# Altium project Thunderscope_Rev4.1.PrjPCB (part 1 of 2)
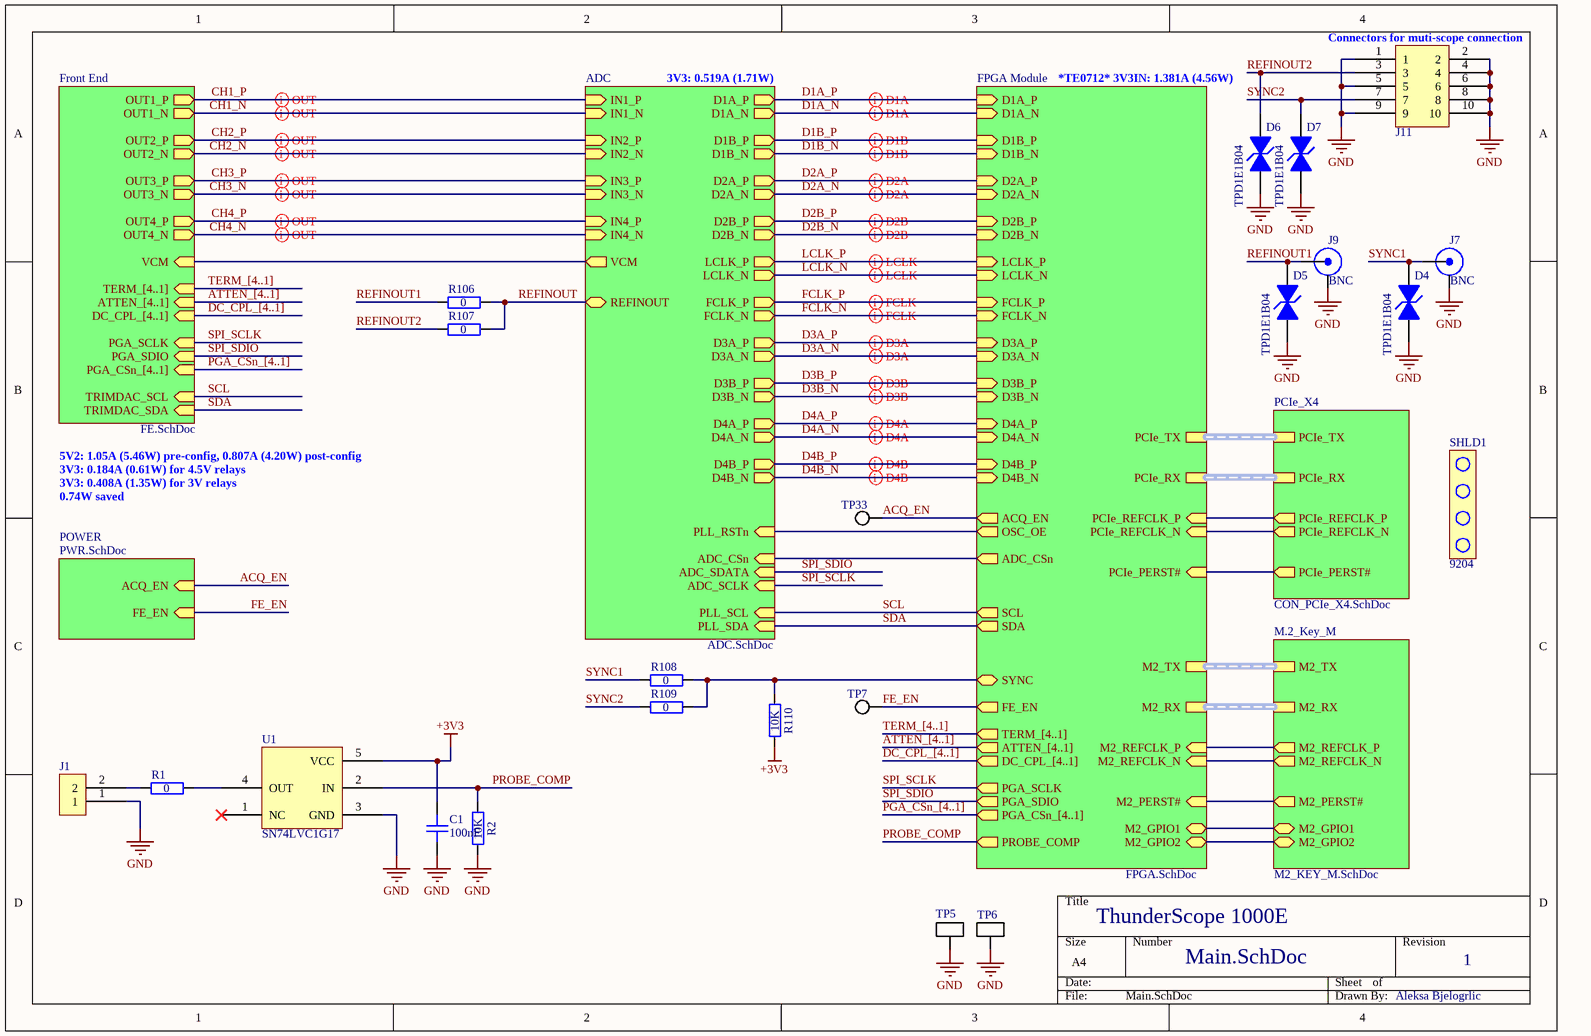
[diagram p0: Main.SchDoc]
Template Notes: - Nominal values used, dimensions in mm  - The mounting holes and keep-out areas around them are only required when the I/O bracket is mounted on the card directly  - Component height rule and clearance rule derived from PCI_Express_CEM_r2.0.pdf, Page 84.  - Stackup is not specified in PCI_Express_CEM_r2.0.pdf, nor implemented in this template.; Template Revision Date: Oct 29, 2010; Template Source Document: Outline:PCI_Express_CEM_r2.0.pdf  Pinout:PCI_Express_CEM_r2.0.pdf; Template Source Organization: PCI-SIG; Template Source Revision Date: R2.0, April 11, 2007; Template Source URL: http://www.pcisig.com; Title: ThunderScope 1000E
8 sheets, 654 parts. Net scope: hierarchical (ports join the sheet entries above them; power ports are global).
Board file: Thunderscope_Rev4.1.PCBDOC
Sheets:
  Main.SchDoc
    Front End = FE.SchDoc
      CH1 = FE_Channel.SchDoc
      CH2 = FE_Channel.SchDoc
      CH3 = FE_Channel.SchDoc
      CH4 = FE_Channel.SchDoc
    ADC = ADC.SchDoc
      PLL = PLL.SchDoc
    FPGA Module = FPGA.SchDoc
    M.2_Key_M = M2_KEY_M.SchDoc
    POWER = PWR.SchDoc

## Sheet Main.SchDoc: ThunderScope 1000E
size A4; DrawnBy: Aleksa Bjelogrlic; Revision: 1

### Parts
C1  100nF  [GEN_C_0402]
D4  TPD1E1B04  [TI_X1SON_DPY0002A]
D5  TPD1E1B04  [TI_X1SON_DPY0002A]
D6  TPD1E1B04  [TI_X1SON_DPY0002A]
D7  TPD1E1B04  [TI_X1SON_DPY0002A]
J1  TSW-101-08-F-D-RA  [GEN_2.54mm_1x2_Pin_TH_RA]  (value not drawn)
J7  BNC  [MOL_0731000105]
J9  BNC  [MOL_0731000105]
J11  1.27mm 6 Pin TH  [GEN_1.27mm_2x5_Pin_TH_RA]  (value not drawn)
R1  0  [GEN_R_0402]
R2  10K  [GEN_R_0402]
R106  0  [GEN_R_0402]
R107  0  [GEN_R_0402]
R108  0  [GEN_R_0402]
R109  0  [GEN_R_0402]
R110  10K  [GEN_R_0402]
SHLD1  9204  (mechanical)
TP5  5019  [KEY_5019]  (value not drawn)
TP6  5019  [KEY_5019]  (value not drawn)
TP7  PCB  [GEN_TP_PCB]  (value not drawn)  (no BOM)
TP33  PCB  [GEN_TP_PCB]  (value not drawn)  (no BOM)
U1  SN74LVC1G17  [GEN_SC-70-5]

### Sub-sheets
ADC = ADC.SchDoc: IN4_N (in), IN4_P (in), IN3_N (in), IN3_P (in), IN2_N (in), IN2_P (in), VCM (out), IN1_N (in), IN1_P (in), ADC_CSn (in), ADC_SDATA (in), ADC_SCLK (in), D1A_N (out), D1A_P (out), D1B_P (out), D1B_N (out), D2A_P (out), D2A_N (out), D2B_N (out), D2B_P (out), LCLK_P (out), LCLK_N (out), FCLK_N (out), FCLK_P (out), D3A_P (out), D3A_N (out), D3B_P (out), D3B_N (out), D4A_P (out), D4A_N (out), D4B_P (out), D4B_N (out), PLL_RSTn (in), PLL_SDA (in), PLL_SCL (in), REFINOUT (bidir)
FPGA Module = FPGA.SchDoc: D1A_P (in), D1A_N (in), D1B_P (in), D1B_N (in), D2A_P (in), D2A_N (in), D2B_P (in), D2B_N (in), LCLK_P (in), LCLK_N (in), FCLK_P (in), FCLK_N (in), D3A_P (in), D3A_N (in), D3B_P (in), D3B_N (in), D4A_P (in), D4A_N (in), D4B_P (in), D4B_N (in), ACQ_EN (out), OSC_OE (out), ADC_CSn (out), SCL (out), SDA (out), FE_EN (out), ATTEN_[4..1] (out), DC_CPL_[4..1] (out), PGA_SCLK (out), PGA_SDIO (out), PGA_CSn_[4..1] (out), PROBE_COMP (out), PCIe_REFCLK_N (in), PCIe_PERST# (in), PCIe_REFCLK_P (in), PCIe_TX (harness PCIe_X4_TX), PCIe_RX (harness PCIe_X4_RX), M2_REFCLK_N (in), M2_PERST# (in), M2_REFCLK_P (in), M2_TX (harness M2_X4_TX), M2_RX (harness M2_X4_RX), TERM_[4..1] (out), M2_GPIO1 (bidir), M2_GPIO2 (bidir), SYNC (bidir)
Front End = FE.SchDoc: OUT1_P (out), OUT1_N (out), OUT3_P (out), OUT3_N (out), OUT4_N (out), OUT2_N (out), OUT2_P (out), OUT4_P (out), VCM (in), DC_CPL_[4..1] (in), ATTEN_[4..1] (in), PGA_SCLK (in), PGA_CSn_[4..1] (in), PGA_SDIO (in), TRIMDAC_SCL (in), TRIMDAC_SDA (in), TERM_[4..1] (in)
M.2_Key_M = M2_KEY_M.SchDoc: M2_REFCLK_N (out), M2_PERST# (out), M2_REFCLK_P (out), M2_TX (harness M2_X4_TX), M2_RX (harness M2_X4_RX), M2_GPIO1 (bidir), M2_GPIO2 (bidir)
PCIe_X4 = CON_PCIe_X4.SchDoc (file not in this document): PCIe_REFCLK_N (out), PCIe_PERST# (out), PCIe_REFCLK_P (out), PCIe_TX (harness PCIe_X4_TX), PCIe_RX (harness PCIe_X4_RX)
POWER = PWR.SchDoc: FE_EN (in), ACQ_EN (in)

### Nets
+3V3: C1.1 R110.1 U1.5(VCC)
GND: C1.2 D4.2(A) D5.2(A) D6.2(A) D7.2(A) J1.1 J7.2(SHIELD) J9.2(SHIELD) J11.1 J11.2 J11.4 J11.5 J11.6 J11.8 J11.9 J11.10 R2.1 TP5.1 TP6.1 U1.3(GND)
ACQ_EN: TP33.1 ; sheet FPGA Module/ACQ_EN, sheet POWER/ACQ_EN
ADC_CSn: sheet ADC/ADC_CSn, sheet FPGA Module/ADC_CSn
CH1_N: sheet Front End/OUT1_N, sheet ADC/IN1_N
CH1_P: sheet Front End/OUT1_P, sheet ADC/IN1_P
CH2_N: sheet Front End/OUT2_N, sheet ADC/IN2_N
CH2_P: sheet Front End/OUT2_P, sheet ADC/IN2_P
CH3_N: sheet Front End/OUT3_N, sheet ADC/IN3_N
CH3_P: sheet Front End/OUT3_P, sheet ADC/IN3_P
CH4_N: sheet Front End/OUT4_N, sheet ADC/IN4_N
CH4_P: sheet Front End/OUT4_P, sheet ADC/IN4_P
D1A_N: sheet ADC/D1A_N, sheet FPGA Module/D1A_N
D1A_P: sheet ADC/D1A_P, sheet FPGA Module/D1A_P
D1B_N: sheet ADC/D1B_N, sheet FPGA Module/D1B_N
D1B_P: sheet ADC/D1B_P, sheet FPGA Module/D1B_P
D2A_N: sheet ADC/D2A_N, sheet FPGA Module/D2A_N
D2A_P: sheet ADC/D2A_P, sheet FPGA Module/D2A_P
D2B_N: sheet ADC/D2B_N, sheet FPGA Module/D2B_N
D2B_P: sheet ADC/D2B_P, sheet FPGA Module/D2B_P
D3A_N: sheet ADC/D3A_N, sheet FPGA Module/D3A_N
D3A_P: sheet ADC/D3A_P, sheet FPGA Module/D3A_P
D3B_N: sheet ADC/D3B_N, sheet FPGA Module/D3B_N
D3B_P: sheet ADC/D3B_P, sheet FPGA Module/D3B_P
D4A_N: sheet ADC/D4A_N, sheet FPGA Module/D4A_N
D4A_P: sheet ADC/D4A_P, sheet FPGA Module/D4A_P
D4B_N: sheet ADC/D4B_N, sheet FPGA Module/D4B_N
D4B_P: sheet ADC/D4B_P, sheet FPGA Module/D4B_P
FCLK_N: sheet ADC/FCLK_N, sheet FPGA Module/FCLK_N
FCLK_P: sheet ADC/FCLK_P, sheet FPGA Module/FCLK_P
FE_EN: TP7.1 ; sheet FPGA Module/FE_EN, sheet POWER/FE_EN
LCLK_N: sheet ADC/LCLK_N, sheet FPGA Module/LCLK_N
LCLK_P: sheet ADC/LCLK_P, sheet FPGA Module/LCLK_P
M2_GPIO1: sheet FPGA Module/M2_GPIO1, sheet M.2_Key_M/M2_GPIO1
M2_GPIO2: sheet FPGA Module/M2_GPIO2, sheet M.2_Key_M/M2_GPIO2
M2_PERST#: sheet FPGA Module/M2_PERST#, sheet M.2_Key_M/M2_PERST#
M2_REFCLK_N: sheet FPGA Module/M2_REFCLK_N, sheet M.2_Key_M/M2_REFCLK_N
M2_REFCLK_P: sheet FPGA Module/M2_REFCLK_P, sheet M.2_Key_M/M2_REFCLK_P
PCIe_PERST#: sheet FPGA Module/PCIe_PERST#, sheet PCIe_X4/PCIe_PERST#
PCIe_REFCLK_N: sheet FPGA Module/PCIe_REFCLK_N, sheet PCIe_X4/PCIe_REFCLK_N
PCIe_REFCLK_P: sheet FPGA Module/PCIe_REFCLK_P, sheet PCIe_X4/PCIe_REFCLK_P
PLL_RSTn: sheet ADC/PLL_RSTn, sheet FPGA Module/OSC_OE
PROBE_COMP: R2.2 U1.2(IN) ; sheet FPGA Module/PROBE_COMP
REFINOUT: R106.2 R107.2 ; sheet ADC/REFINOUT
REFINOUT1: D5.1(K) J9.1(Signal) R106.1
REFINOUT2: D6.1(K) J11.3 R107.1
SCL: sheet Front End/TRIMDAC_SCL, sheet ADC/PLL_SCL, sheet FPGA Module/SCL
SDA: sheet Front End/TRIMDAC_SDA, sheet ADC/PLL_SDA, sheet FPGA Module/SDA
SPI_SCLK: sheet Front End/PGA_SCLK, sheet ADC/ADC_SCLK, sheet FPGA Module/PGA_SCLK  [project net ADC_SCLK]
SPI_SDIO: sheet Front End/PGA_SDIO, sheet ADC/ADC_SDATA, sheet FPGA Module/PGA_SDIO  [project net ADC_SDATA]
SYNC: R108.2 R109.2 R110.2 ; sheet FPGA Module/SYNC
SYNC1: D4.1(K) J7.1(Signal) R108.1
SYNC2: D7.1(K) J11.7 R109.1
VCM: sheet Front End/VCM, sheet ADC/VCM
NetJ1_2: J1.2 R1.1
NetR1_2: R1.2 U1.4(OUT)

Not connected (* = marked no-connect by the designer): U1 1(NC)*

### Buses and harness runs
bus ATTEN_[4..1] = sheet FPGA Module/ATTEN_[4..1]
bus ATTEN_[4..1] = sheet Front End/ATTEN_[4..1]
bus DC_CPL_[4..1] = sheet FPGA Module/DC_CPL_[4..1]
bus DC_CPL_[4..1] = sheet Front End/DC_CPL_[4..1]
bus PGA_CSn_[4..1] = sheet FPGA Module/PGA_CSn_[4..1]
bus PGA_CSn_[4..1] = sheet Front End/PGA_CSn_[4..1]
bus TERM_[4..1] = sheet FPGA Module/TERM_[4..1]
bus TERM_[4..1] = sheet Front End/TERM_[4..1]
harness sheet FPGA Module/M2_RX = sheet M.2_Key_M/M2_RX
harness sheet FPGA Module/M2_TX = sheet M.2_Key_M/M2_TX
harness sheet FPGA Module/PCIe_RX = sheet PCIe_X4/PCIe_RX
harness sheet FPGA Module/PCIe_TX = sheet PCIe_X4/PCIe_TX

### Layout directives
differential pair: D1A_N, D1A_P, D1B_N, D1B_P, D2A_N, D2A_P, D2B_N, D2B_P, D3A_N, D3A_P, D3B_N, D3B_P, D4A_N, D4A_P, D4B_N, D4B_P, FCLK_N, FCLK_P, LCLK_N, LCLK_P
differential pair; differential pair class 100Z_Diff_PGA: CH1_N, CH1_P, CH2_N, CH2_P, CH3_N, CH3_P, CH4_N, CH4_P

### Notes on the sheet
- (near J11) Connectors for muti-scope connection
- 3V3: 0.519A (1.71W)
- *TE0712* 3V3IN: 1.381A (4.56W)
- 5V2: 1.05A (5.46W) pre-config, 0.807A (4.20W) post-config
- 3V3: 0.184A (0.61W) for 4.5V relays
- 3V3: 0.408A (1.35W) for 3V relays
- 0.74W saved
- Aleksa Bjelogrlic

### Library data of the parts
C1 = CAP 100nF 16V X7R 0402: Voltage Rating: 16V; Package: 0402; Supplier 1: Digi-Key; Supplier Part Number 1: 490-4759-1-ND; Value: 100nF
D4-D7 = TVS TPD1E1B04: Supplier 1: Digi-Key; Supplier Part Number 1: 296-47364-1-ND
J1 = CONN 2.54mm 2 Pin TH RA: Supplier 1: Digi-Key; Supplier Part Number 1: SAM12296-ND
J7 J9 = BNC JACK R/A: Supplier 1: Digi-Key; Supplier Part Number 1: WM5524-ND
J11 = CONN 1.27mm 2x5 Pin TH RA: Supplier 1: Digi-Key; Supplier Part Number 1: 1175-1628-ND
R1 R106-R109 = RES 0 OHM 1/16W 0402: Power Rating: 0.0625W; Package: 0402; Supplier 1: Digi-Key; Supplier Part Number 1: 311-0.0JRCT-ND; Value: 0
R2 R110 = RES 10K OHM 1% 1/10W 0402: Tolerance: 1%; Power Rating: 0.1W; Package: 0402; Supplier 1: Digi-Key; Supplier Part Number 1: P10.0KLCT-ND; Value: 10K
SHLD1 = PCIe IO Shield: Supplier 1: Mouser; Supplier Part Number 1: 534-9204
TP5 TP6 = TP KEYSTONE 5019: Supplier 1: Digi-Key; Supplier Part Number 1: 36-5019CT-ND
TP7 TP33 = TP PCB 1mm
U1 = IC BUFFER SN74LVC1G17: Supplier 1: Digi-Key; Supplier Part Number 1: 296-11934-1-ND

## Sheet FE.SchDoc: ThunderScope 1000E
size A4; Revision: 1
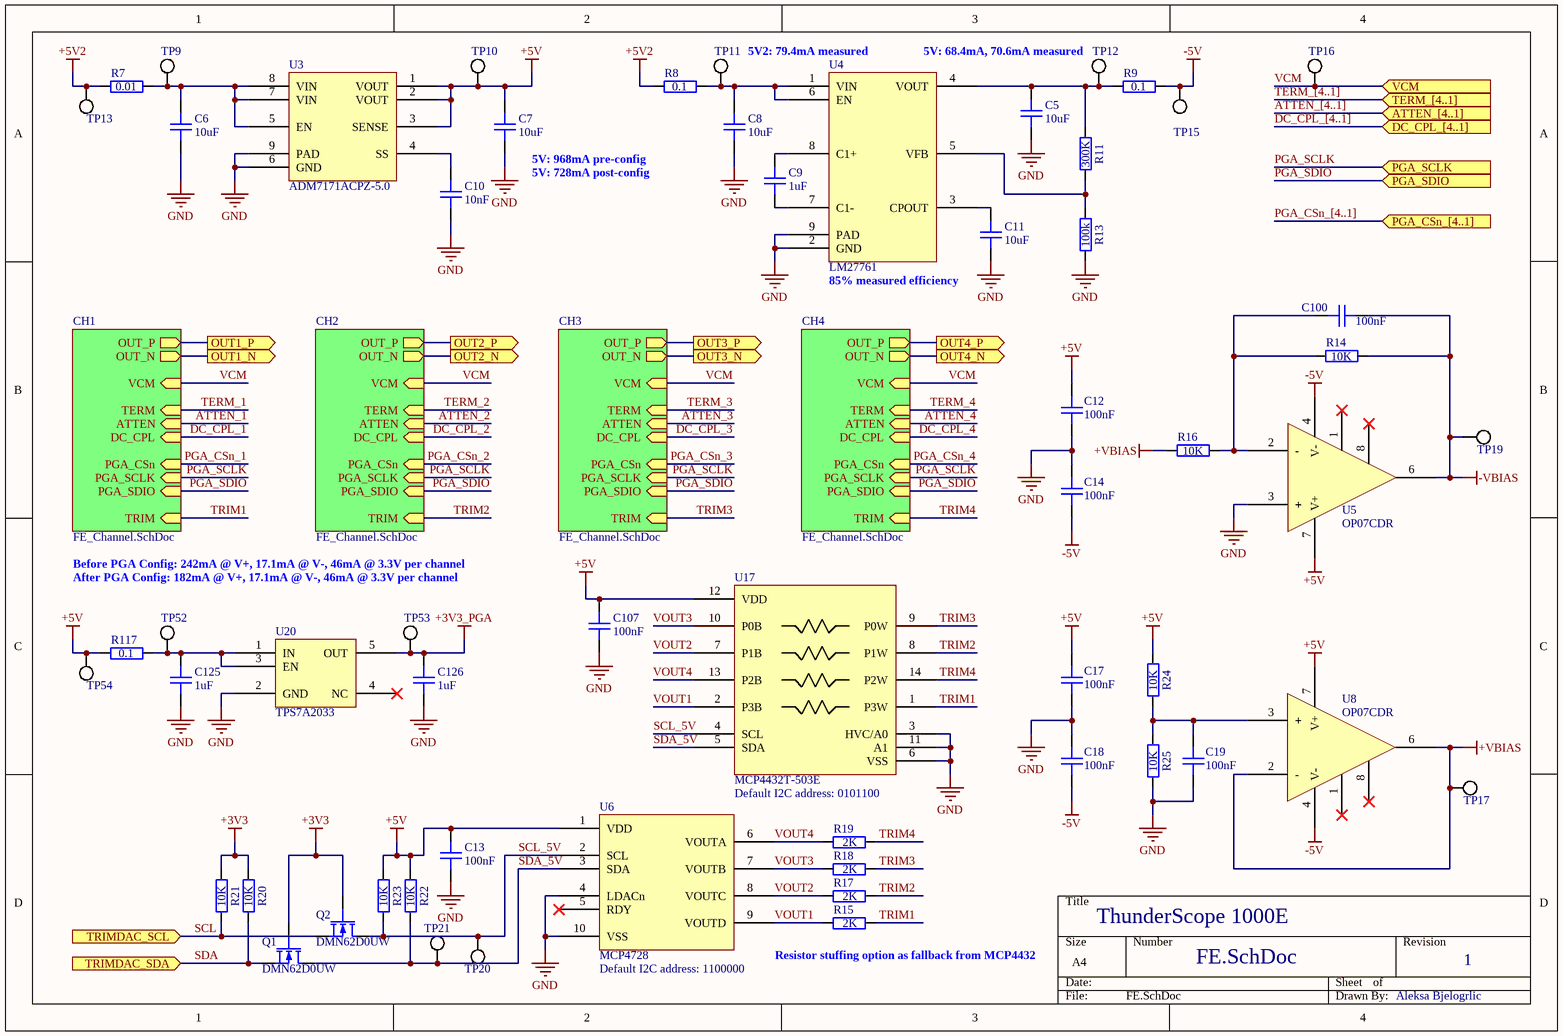
[diagram p1: FE.SchDoc]

### Parts
C5  10uF  [GEN_C_0603]
C6  10uF  [GEN_C_0603]
C7  10uF  [GEN_C_0603]
C8  10uF  [GEN_C_0603]
C9  1uF  [GEN_C_0402]
C10  10nF  [GEN_C_0402]
C11  10uF  [GEN_C_0603]
C12  100nF  [GEN_C_0402]
C13  100nF  [GEN_C_0402]
C14  100nF  [GEN_C_0402]
C17  100nF  [GEN_C_0402]
C18  100nF  [GEN_C_0402]
C19  100nF  [GEN_C_0402]
C100  100nF  [GEN_C_0402]
C107  100nF  [GEN_C_0402]
C125  1uF  [GEN_C_0402]
C126  1uF  [GEN_C_0402]
Q1  DMN62D0UW  [GEN_SOT_323]
Q2  DMN62D0UW  [GEN_SOT_323]
R7  0.01  [GEN_R_0603]
R8  0.1  [GEN_R_0402]
R9  0.1  [GEN_R_0402]
R11  300K  [GEN_R_0402]
R13  100k  [GEN_R_0402]
R14  10K  [GEN_R_0402]
R15  2K  [GEN_R_0402]
R16  10K  [GEN_R_0402]
R17  2K  [GEN_R_0402]
R18  2K  [GEN_R_0402]
R19  2K  [GEN_R_0402]
R20  10K  [GEN_R_0402]
R21  10K  [GEN_R_0402]
R22  10K  [GEN_R_0402]
R23  10K  [GEN_R_0402]
R24  10K  [GEN_R_0402]
R25  10K  [GEN_R_0402]
R117  0.1  [GEN_R_0402]
TP9  PCB  [GEN_TP_PCB]  (value not drawn)  (no BOM)
TP10  PCB  [GEN_TP_PCB]  (value not drawn)  (no BOM)
TP11  PCB  [GEN_TP_PCB]  (value not drawn)  (no BOM)
TP12  PCB  [GEN_TP_PCB]  (value not drawn)  (no BOM)
TP13  PCB  [GEN_TP_PCB]  (value not drawn)  (no BOM)
TP15  PCB  [GEN_TP_PCB]  (value not drawn)  (no BOM)
TP16  PCB  [GEN_TP_PCB]  (value not drawn)  (no BOM)
TP17  PCB  [GEN_TP_PCB]  (value not drawn)  (no BOM)
TP19  PCB  [GEN_TP_PCB]  (value not drawn)  (no BOM)
TP20  PCB  [GEN_TP_PCB]  (value not drawn)  (no BOM)
TP21  PCB  [GEN_TP_PCB]  (value not drawn)  (no BOM)
TP52  PCB  [GEN_TP_PCB]  (value not drawn)  (no BOM)
TP53  PCB  [GEN_TP_PCB]  (value not drawn)  (no BOM)
TP54  PCB  [GEN_TP_PCB]  (value not drawn)  (no BOM)
U3  ADM7171ACPZ-5.0  [AD_DFN8_CP-8-21]
U4  LM27761  [TI_WSON8_DSG0008A]
U5  OP07CDR  [TI_SOIC8_D0008A]
U6  MCP4728  [MC_MSOP10_UN]
U8  OP07CDR  [TI_SOIC8_D0008A]
U17  MCP4432T-503E  [MC_TSSOP14]
U20  TPS7A2033  [GEN_SOT23_5_950_2900X1600X1450]

### Sub-sheets
CH1 = FE_Channel.SchDoc: OUT_P (out), VCM (in), OUT_N (out), TRIM (in), ATTEN (in), DC_CPL (in), PGA_CSn (in), PGA_SCLK (in), PGA_SDIO (in), TERM (in)
CH2 = FE_Channel.SchDoc: OUT_P (out), VCM (in), OUT_N (out), TRIM (in), ATTEN (in), DC_CPL (in), PGA_CSn (in), PGA_SCLK (in), PGA_SDIO (in), TERM (in)
CH3 = FE_Channel.SchDoc: OUT_P (out), VCM (in), OUT_N (out), TRIM (in), ATTEN (in), DC_CPL (in), PGA_CSn (in), PGA_SCLK (in), PGA_SDIO (in), TERM (in)
CH4 = FE_Channel.SchDoc: OUT_P (out), VCM (in), OUT_N (out), TRIM (in), ATTEN (in), DC_CPL (in), PGA_CSn (in), PGA_SCLK (in), PGA_SDIO (in), TERM (in)

### Ports
ATTEN_[4..1] (in), DC_CPL_[4..1] (in), OUT1_N (out), OUT1_P (out), OUT2_N (out), OUT2_P (out), OUT3_N (out), OUT3_P (out), OUT4_N (out), OUT4_P (out), PGA_CSn_[4..1] (in), PGA_SCLK (in), PGA_SDIO (in), TERM_[4..1] (in), TRIMDAC_SCL (in), TRIMDAC_SDA (in), VCM (in)

### Nets
+3V3: Q1.2(G) Q2.2(G) R20.2 R21.2
+3V3_PGA: C126.2 TP53.1 U20.5(OUT)
+5V: C7.2 C12.1 C13.2 C17.1 C107.2 R22.2 R23.2 R24.2 R117.1 TP10.1 TP54.1 U3.1(VOUT) U3.2(VOUT) U3.3(SENSE) U5.7(V+) U6.1(VDD) U8.7(V+) U17.12(VDD)
+5V2: R7.1 R8.1 TP13.1
+VBIAS: R16.1 TP17.1 U8.2(-) U8.6(OUT)
-5V: C14.2 C18.2 R9.2 TP15.1 U5.4(V-) U8.4(V-)
-VBIAS: C100.1 R14.2 TP19.1 U5.6(OUT)
GND: C5.1 C6.1 C7.1 C8.1 C10.1 C11.1 C12.2 C13.1 C14.1 C17.2 C18.1 C19.1 C107.1 C125.1 C126.1 R13.1 R25.1 U3.6(GND) U3.9(PAD) U4.2(GND) U4.9(PAD) U5.3(+) U6.4(LDACn) U6.10(VSS) U17.3(HVC/A0) U17.6(VSS) U17.11(A1) U20.2(GND)
CH1_N: port OUT1_N, sheet CH1/OUT_N
CH1_P: port OUT1_P, sheet CH1/OUT_P
CH2_N: port OUT2_N, sheet CH2/OUT_N
CH2_P: port OUT2_P, sheet CH2/OUT_P
CH3_N: port OUT3_N, sheet CH3/OUT_N
CH3_P: port OUT3_P, sheet CH3/OUT_P
CH4_N: port OUT4_N, sheet CH4/OUT_N
CH4_P: port OUT4_P, sheet CH4/OUT_P
PGA_SCLK: port PGA_SCLK, sheet CH1/PGA_SCLK, sheet CH2/PGA_SCLK, sheet CH3/PGA_SCLK, sheet CH4/PGA_SCLK  [project net ADC_SCLK]
PGA_SDIO: port PGA_SDIO, sheet CH1/PGA_SDIO, sheet CH2/PGA_SDIO, sheet CH3/PGA_SDIO, sheet CH4/PGA_SDIO  [project net ADC_SDATA]
SCL: Q2.3(S) R21.1 ; port TRIMDAC_SCL
SCL_5V: Q2.1(D) R23.1 TP20.1 U6.2(SCL) U17.4(SCL)
SDA: Q1.3(S) R20.1 ; port TRIMDAC_SDA
SDA_5V: Q1.1(D) R22.1 TP21.1 U6.3(SDA) U17.5(SDA)
TRIM1: R15.1 U17.1(P3W) ; sheet CH1/TRIM
TRIM2: R17.1 U17.8(P1W) ; sheet CH2/TRIM
TRIM3: R18.1 U17.9(P0W) ; sheet CH3/TRIM
TRIM4: R19.1 U17.14(P2W) ; sheet CH4/TRIM
VCM: TP16.1 ; port VCM, sheet CH1/VCM, sheet CH2/VCM, sheet CH3/VCM, sheet CH4/VCM
VOUT1: R15.2 U6.9(VOUTD) U17.2(P3B)
VOUT2: R17.2 U6.8(VOUTC) U17.7(P1B)
VOUT3: R18.2 U6.7(VOUTB) U17.10(P0B)
VOUT4: R19.2 U6.6(VOUTA) U17.13(P2B)
NetC5_2: C5.2 R9.1 R11.2 TP12.1 U4.4(VOUT)
NetC6_2: C6.2 R7.2 TP9.1 U3.5(EN) U3.7(VIN) U3.8(VIN)
NetC8_2: C8.2 R8.2 TP11.1 U4.1(VIN) U4.6(EN)
NetC9_1: C9.1 U4.7(C1-)
NetC9_2: C9.2 U4.8(C1+)
NetC10_2: C10.2 U3.4(SS)
NetC11_2: C11.2 U4.3(CPOUT)
NetC19_2: C19.2 R24.1 R25.2 U8.3(+)
NetC100_2: C100.2 R14.1 R16.2 U5.2(-)
NetC125_2: C125.2 R117.2 TP52.1 U20.1(IN) U20.3(EN)
NetR11_1: R11.1 R13.2 U4.5(VFB)

Not connected (* = marked no-connect by the designer): U5 1(N1)* 8(N2)*; U6 5(RDY)*; U8 1(N1)* 8(N2)*; U20 4(NC)*

### Buses and harness runs
bus ATTEN_[4..1] = port ATTEN_[4..1]
bus DC_CPL_[4..1] = port DC_CPL_[4..1]
bus PGA_CSn_[4..1] = port PGA_CSn_[4..1]
bus TERM_[4..1] = port TERM_[4..1]

### Notes on the sheet
- 5V2: 79.4mA measured
- 5V: 68.4mA, 70.6mA measured
- (near C7) 5V: 968mA pre-config
- (near C7) 5V: 728mA post-config
- 85% measured efficiency
- Before PGA Config: 242mA @ V+, 17.1mA @ V-, 46mA @ 3.3V per channel
- After PGA Config: 182mA @ V+, 17.1mA @ V-, 46mA @ 3.3V per channel
- Default I2C address: 0101100
- (near U6) Default I2C address: 1100000
- Resistor stuffing option as fallback from MCP4432
- Aleksa Bjelogrlic

### Library data of the parts
C5-C8 C11 = CAP 10uF 10V X5R 0603: Voltage Rating: 10V; Package: 0402; Supplier 1: Digi-Key; Supplier Part Number 1: 490-10474-1-ND; Value: 10uF
C9 C125 C126 = CAP 1uF 25V X5R 0402: Voltage Rating: 25V; Package: 0402; Supplier 1: Digi-Key; Supplier Part Number 1: 490-10017-1-ND; Value: 1uF
C10 = CAP 10nF 50V X7R 0402: Manufacturer: Murata; House Part Number: C-10nF-0402-002; Manufacturer Part Number: GRM155R71H103KA88J; Voltage Rating: 50V; Package: 0402; Supplier 1: Digi-Key; Supplier Part Number 1: 490-6351-1-ND; Value: 10nF
C12-C14 C17-C19 C100 C107 = CAP 100nF 16V X7R 0402: Voltage Rating: 16V; Package: 0402; Supplier 1: Digi-Key; Supplier Part Number 1: 490-4759-1-ND; Value: 100nF
Q1 Q2 = NMOS DMN62D0UW: Vdss: 60V; Id: 340mA; Max Power: 320mW; Supplier 1: Digi-Key; Supplier Part Number 1: DMN62D0UW-7DICT-ND
R7 = RES 0.01 OHM 1% 1/4W 0603: Tolerance: 1%; Power Rating: 0.25W; Supplier 1: Digi-Key; Supplier Part Number 1: 408-1404-1-ND; Value: 0.01; Package: 0603
R8 R9 R117 = RES 0.1 OHM 1% 1/6W 0402: Tolerance: 1%; Power Rating: 0.16W; Package: 0402; Supplier 1: Digi-Key; Supplier Part Number 1: P.10AKCT-ND; Value: 0.1
R11 = RES 300K OHM 1% 1/10W 0402: Manufacturer: Panasonic; Manufacturer Part Number: ERJ-2RKF3003X; Tolerance: 1%; Package: 0402; Supplier 1: Digi-Key; Supplier Part Number 1: P300KLCT-ND; Value: 300K
R13 = RES 100K OHM 1% 1/10W 0402: Tolerance: 1%; Power Rating: 0.1W; Package: 0402; Supplier 1: Digi-Key; Supplier Part Number 1: 311-100KLRCT-ND; Value: 100k
R14 R16 R20-R25 = RES 10K OHM 1% 1/10W 0402: Tolerance: 1%; Power Rating: 0.1W; Package: 0402; Supplier 1: Digi-Key; Supplier Part Number 1: P10.0KLCT-ND; Value: 10K
R15 R17-R19 = RES 2K OHM 1% 1/16W 0402: Tolerance: 1%; Power Rating: 0.0625W; Package: 0402; Supplier 1: Digi-Key; Supplier Part Number 1: 311-2KLRCT-ND; Value: 2K
TP9-TP13 TP15-TP17 TP19-TP21 TP52-TP54 = TP PCB 1mm
U3 = IC LDO ADM7171ACPZ-5.0: Supplier 1: Digi-Key; Supplier Part Number 1: 505-ADM7171ACPZ-5.0-R7CT-ND
U4 = IC CPUMP LM27761: Supplier 1: Digi-Key; Supplier Part Number 1: 296-44379-1-ND
U5 U8 = IC OPAMP OP07CDR: Supplier 1: Digi-Key; Supplier Part Number 1: 296-14626-1-ND
U6 = IC DAC QUAD MCP4728: Supplier 1: Digi-Key; Supplier Part Number 1: MCP4728A1T-E/UNCT-ND
U17 = IC DIGIPOT QUAD MCP4432T-503E: Supplier 1: Mouser; Supplier Part Number 1: 579-MCP4432T-503E/ST
U20 = IC LDO TPS7A2033: Manufacturer: Texas Instruments; Manufacturer Part Number: TPS7A2033PDBVR; Supplier 1: Mouser; Supplier Part Number 1: 595-TPS7A2033PDBVR

## Sheet FE_Channel.SchDoc: ThunderScope 1000E
size A3; DrawnBy: Aleksa Bjelogrlic; Revision: 1
Used 4 times, as channels Front End/CH1, Front End/CH2, Front End/CH3, Front End/CH4. Parts and nets are listed once, with the designators drawn on the sheet.
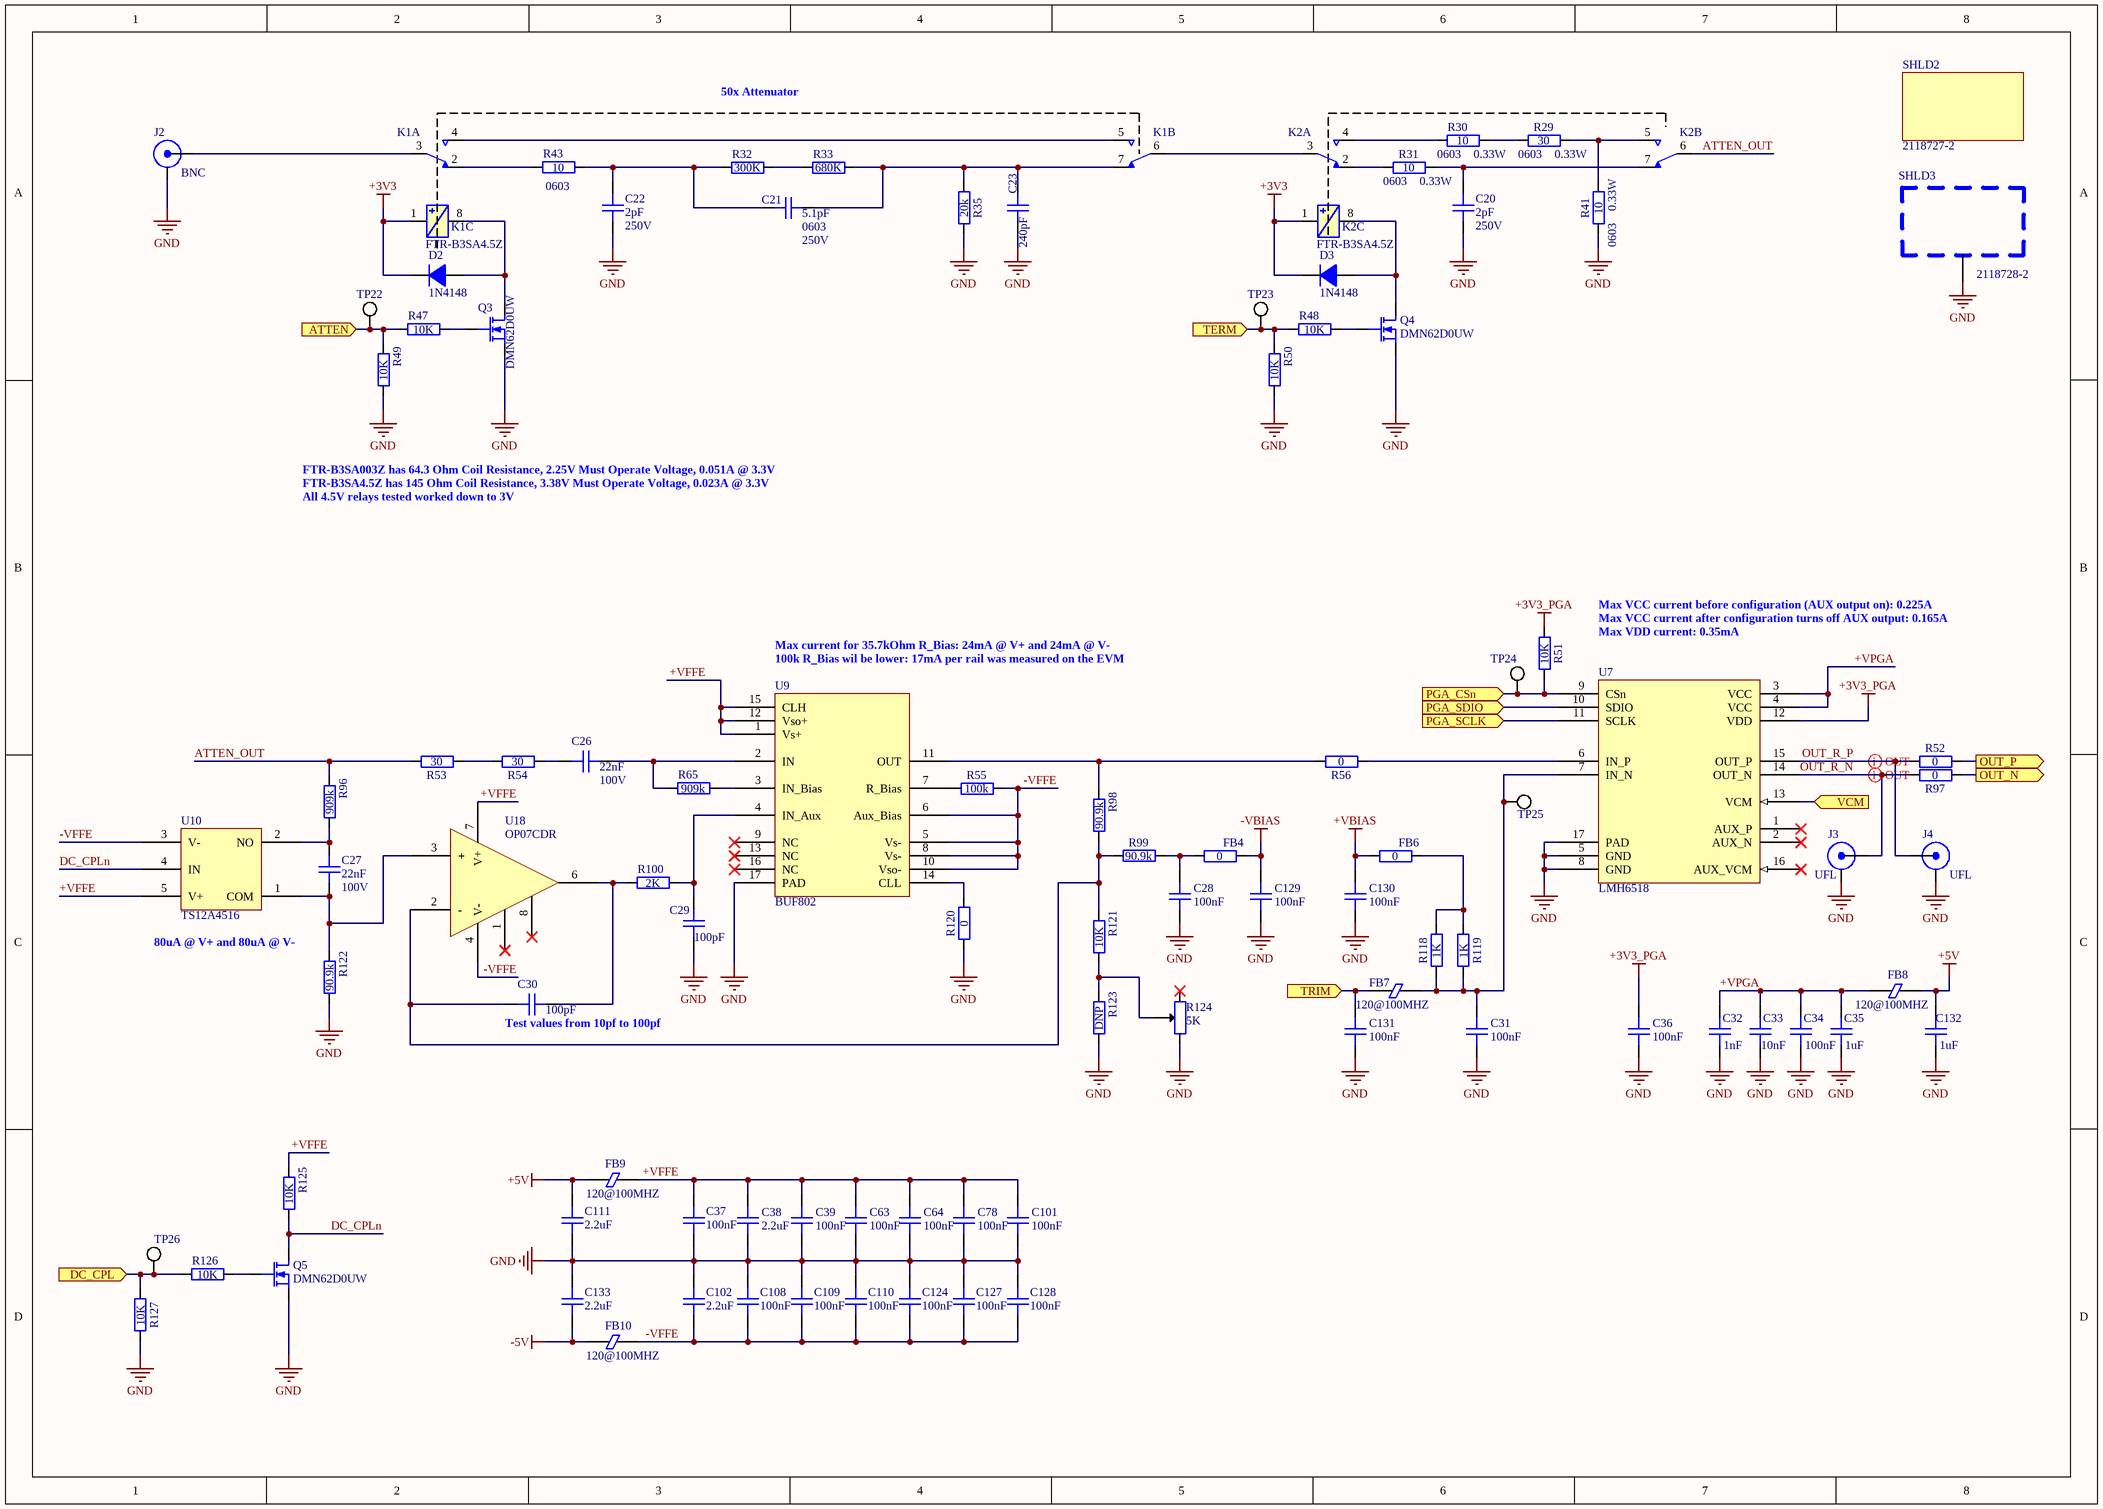
[diagram p2: FE_Channel.SchDoc]

### Parts
C20  2pF  Voltage Rating: 250V  [GEN_C_0603]
C21  5.1pF  Package: 0603  Voltage Rating: 250V  [GEN_C_0603]
C22  2pF  Voltage Rating: 250V  [GEN_C_0603]
C23  240pF  [GEN_C_0805]
C26  22nF  Voltage Rating: 100V  [GEN_C_0603]
C27  22nF  Voltage Rating: 100V  [GEN_C_0603]
C28  100nF  [GEN_C_0402]
C29  100pF  [GEN_C_0402]
C30  100pF  [GEN_C_0402]
C31  100nF  [GEN_C_0402]
C32  1nF  [GEN_C_0402]
C33  10nF  [GEN_C_0402]
C34  100nF  [GEN_C_0402]
C35  1uF  [GEN_C_0402]
C36  100nF  [GEN_C_0402]
C37  100nF  [GEN_C_0402]
C38  2.2uF  [GEN_C_0402]
C39  100nF  [GEN_C_0402]
C63  100nF  [GEN_C_0402]
C64  100nF  [GEN_C_0402]
C78  100nF  [GEN_C_0402]
C101  100nF  [GEN_C_0402]
C102  2.2uF  [GEN_C_0402]
C108  100nF  [GEN_C_0402]
C109  100nF  [GEN_C_0402]
C110  100nF  [GEN_C_0402]
C111  2.2uF  [GEN_C_0402]
C124  100nF  [GEN_C_0402]
C127  100nF  [GEN_C_0402]
C128  100nF  [GEN_C_0402]
C129  100nF  [GEN_C_0402]
C130  100nF  [GEN_C_0402]
C131  100nF  [GEN_C_0402]
C132  1uF  [GEN_C_0402]
C133  2.2uF  [GEN_C_0402]
D2  1N4148  [GEN_SOD_323]
D3  1N4148  [GEN_SOD_323]
FB4  0  [GEN_R_0402]
FB6  0  [GEN_R_0402]
FB7  120@100MHZ  [GEN_R_0402]
FB8  120@100MHZ  [GEN_R_0402]
FB9  120@100MHZ  [GEN_R_0402]
FB10  120@100MHZ  [GEN_R_0402]
J2  BNC  [MOL_0731000105]
J3  UFL  [TE_2334884-1]
J4  UFL  [TE_2334884-1]
K1  FTR-B3SA4.5Z  [FUJ_FTR-B3SA]  (value not drawn)  (parts A,B,C of 3)
K2  FTR-B3SA4.5Z  [FUJ_FTR-B3SA]  (value not drawn)  (parts A,B,C of 3)
Q3  DMN62D0UW  [GEN_SOT_323]
Q4  DMN62D0UW  [GEN_SOT_323]
Q5  DMN62D0UW  [GEN_SOT_323]
R29  30  Power Rating: 0.33W  Package: 0603  [GEN_R_0603]
R30  10  Package: 0603  Power Rating: 0.33W  [GEN_R_0603]
R31  10  Package: 0603  Power Rating: 0.33W  [GEN_R_0603]
R32  300K  [GEN_R_0402]
R33  680K  [GEN_R_0402]
R35  20k  [GEN_R_0402]
R41  10  Power Rating: 0.33W  Package: 0603  [GEN_R_0603]
R43  10  Package: 0603  [GEN_R_0603]
R47  10K  [GEN_R_0402]
R48  10K  [GEN_R_0402]
R49  10K  [GEN_R_0402]
R50  10K  [GEN_R_0402]
R51  10K  [GEN_R_0402]
R52  0  [GEN_R_0402]
R53  30  [GEN_R_0603]
R54  30  [GEN_R_0603]
R55  100k  [GEN_R_0402]
R56  0  [GEN_R_0402]
R65  909k  [GEN_R_0402]
R96  909k  [GEN_R_0402]
R97  0  [GEN_R_0402]
R98  90.9k  [GEN_R_0402]
R99  90.9k  [GEN_R_0402]
R100  2K  [GEN_R_0402]
R118  1K  [GEN_R_0402]
R119  1K  [GEN_R_0402]
R120  0  [GEN_R_0402]
R121  10K  [GEN_R_0402]
R122  90.9k  [GEN_R_0402]
R123  DNP  [GEN_R_0402]  (no BOM)
R124  5K  [BOU_3mm_POT]
R125  10K  [GEN_R_0402]
R126  10K  [GEN_R_0402]
R127  10K  [GEN_R_0402]
SHLD2  2118727-2  (mechanical)
SHLD3  2118728-2  [TE_2118728-2]
TP22  PCB  [GEN_TP_PCB]  (value not drawn)  (no BOM)
TP23  PCB  [GEN_TP_PCB]  (value not drawn)  (no BOM)
TP24  PCB  [GEN_TP_PCB]  (value not drawn)  (no BOM)
TP25  PCB  [GEN_TP_PCB]  (value not drawn)  (no BOM)
TP26  PCB  [GEN_TP_PCB]  (value not drawn)  (no BOM)
U7  LMH6518  [TI_WQFN_RGH0016A]
U9  BUF802  [TI_VQFN_RGT0016C]
U10  TS12A4516  [GEN_SOT23_5_950_2900X1600X1450]
U18  OP07CDR  [TI_SOIC8_D0008A]

### Ports
ATTEN (in), DC_CPL (in), OUT_N (out), OUT_P (out), PGA_CSn (in), PGA_SCLK (in), PGA_SDIO (in), TERM (in), TRIM (in), VCM (in)

### Nets
+3V3: D2.1(K) D3.1(K) K1.1 K2.1
+3V3_PGA: C36.2 R51.2 U7.12(VDD)
+5V: C111.2 C132.2 FB8.2 FB9.1
+VBIAS: C130.1 FB6.1
-5V: C133.1 FB10.1
-VBIAS: C129.1 FB4.2
GND: C20.2 C22.1 C23.1 C28.2 C29.1 C31.2 C32.1 C33.1 C34.1 C35.1 C36.1 C37.1 C38.2 C39.2 C63.2 C64.1 C78.1 C101.1 C102.1 C108.1 C109.2 C110.2 C111.1 C124.2 C127.1 C128.1 C129.2 C130.2 C131.2 C132.1 C133.2 J2.2(SHIELD) J3.2(SHIELD) J4.2(SHIELD) Q3.3(S) Q4.3(S) Q5.3(S) R35.1 R41.1 R49.1 R50.1 R120.1 R122.1 R123.1 R124.3 R127.1 SHLD3.1 U7.5(GND) U7.8(GND) U7.17(PAD) U9.17(PAD)
+VFFE: C37.2 C38.1 C39.1 C63.1 C64.2 C78.2 C101.2 FB9.2 R125.2 U9.1(Vs+) U9.12(Vso+) U9.15(CLH) U10.5(V+) U18.7(V+)
+VPGA: C32.2 C33.2 C34.2 C35.2 FB8.1 U7.3(VCC) U7.4(VCC)
-VFFE: C102.2 C108.2 C109.1 C110.1 C124.1 C127.2 C128.2 FB10.2 R55.2 U9.5(Vs-) U9.6(Aux_Bias) U9.8(Vs-) U9.10(Vso-) U10.3(V-) U18.4(V-)
ATTEN: R47.2 R49.2 TP22.1 ; port ATTEN
ATTEN_OUT: K2.6 R53.1 R96.2
DC_CPL: R126.2 R127.2 TP26.1 ; port DC_CPL
DC_CPLn: Q5.1(D) R125.1 U10.4(IN)
OUT_N: R97.2 ; port OUT_N
OUT_P: R52.2 ; port OUT_P
OUT_R_N: J3.1(Signal) R97.1 U7.14(OUT_N)
OUT_R_P: J4.1(Signal) R52.1 U7.15(OUT_P)
PGA_CSn: R51.1 TP24.1 U7.9(CSn) ; port PGA_CSn
PGA_SCLK: U7.11(SCLK) ; port PGA_SCLK
PGA_SDIO: U7.10(SDIO) ; port PGA_SDIO
TERM: R48.2 R50.2 TP23.1 ; port TERM
TRIM: C131.1 FB7.1 ; port TRIM
VCM: U7.13(VCM) ; port VCM
NetC20_1: C20.1 K2.7 R31.2
NetC21_1: C21.1 C23.2 K1.7 R33.2 R35.2
NetC21_2: C21.2 C22.2 R32.1 R43.1
NetC26_1: C26.1 R65.2 U9.2(IN)
NetC26_2: C26.2 R54.2
NetC27_1: C27.1 R96.1 U10.2(NO)
NetC27_2: C27.2 R122.2 U10.1(COM) U18.3(+)
NetC28_1: C28.1 FB4.1 R99.1
NetC29_2: C29.2 R100.1 U9.4(IN_Aux)
NetC30_1: C30.1 R100.2 U18.6(OUT)
NetC30_2: C30.2 R98.1 R99.2 R121.2 U18.2(-)
NetC31_1: C31.1 FB7.2 R118.1 R119.2 TP25.1 U7.7(IN_N)
NetD2_2: D2.2(A) K1.8 Q3.1(D)
NetD3_2: D3.2(A) K2.8 Q4.1(D)
NetFB6_2: FB6.2 R118.2 R119.1
NetJ2_1: J2.1(Signal) K1.3
NetK1_2: K1.2 R43.2
NetK1_4: K1.4 K1.5
NetK1_6: K1.6 K2.3
NetK2_2: K2.2 R31.1
NetK2_4: K2.4 R30.1
NetK2_5: K2.5 R29.2 R41.2
NetQ3_2: Q3.2(G) R47.1
NetQ4_2: Q4.2(G) R48.1
NetQ5_2: Q5.2(G) R126.1
NetR29_1: R29.1 R30.2
NetR32_2: R32.2 R33.1
NetR53_2: R53.2 R54.1
NetR55_1: R55.1 U9.7(R_Bias)
NetR56_1: R56.1 R98.2 U9.11(OUT)
NetR56_2: R56.2 U7.6(IN_P)
NetR65_1: R65.1 U9.3(IN_Bias)
NetR120_2: R120.2 U9.14(CLL)
NetR121_1: R121.1 R123.2 R124.2

Not connected (* = marked no-connect by the designer): R124 1*; U7 1(AUX_P)* 2(AUX_N)* 16(AUX_VCM)*; U9 9(NC)* 13(NC)* 16(NC)*; U18 1(N1)* 8(N2)*

### Channels
Front End/CH1: designators end in A; ports ATTEN=ATTEN_1 DC_CPL=DC_CPL_1 OUT_N=CH1_N OUT_P=CH1_P PGA_CSn=PGA_CSn_1 PGA_SCLK=ADC_SCLK PGA_SDIO=ADC_SDATA TERM=TERM_1 TRIM=TRIM1 VCM=VCM
Front End/CH2: designators end in B; ports ATTEN=ATTEN_2 DC_CPL=DC_CPL_2 OUT_N=CH2_N OUT_P=CH2_P PGA_CSn=PGA_CSn_2 PGA_SCLK=ADC_SCLK PGA_SDIO=ADC_SDATA TERM=TERM_2 TRIM=TRIM2 VCM=VCM
Front End/CH3: designators end in C; ports ATTEN=ATTEN_3 DC_CPL=DC_CPL_3 OUT_N=CH3_N OUT_P=CH3_P PGA_CSn=PGA_CSn_3 PGA_SCLK=ADC_SCLK PGA_SDIO=ADC_SDATA TERM=TERM_3 TRIM=TRIM3 VCM=VCM
Front End/CH4: designators end in D; ports ATTEN=ATTEN_4 DC_CPL=DC_CPL_4 OUT_N=CH4_N OUT_P=CH4_P PGA_CSn=PGA_CSn_4 PGA_SCLK=ADC_SCLK PGA_SDIO=ADC_SDATA TERM=TERM_4 TRIM=TRIM4 VCM=VCM

### Layout directives
differential pair; differential pair class 100Z_Diff_PGA: OUT_R_N_CH1, OUT_R_P_CH1

### Notes on the sheet
- 50x Attenuator
- FTR-B3SA003Z has 64.3 Ohm Coil Resistance, 2.25V Must Operate Voltage, 0.051A @ 3.3V
- FTR-B3SA4.5Z has 145 Ohm Coil Resistance, 3.38V Must Operate Voltage, 0.023A @ 3.3V
- All 4.5V relays tested worked down to 3V
- Max current for 35.7kOhm R_Bias: 24mA @ V+ and 24mA @ V-
- Max VCC current before configuration (AUX output on): 0.225A
- Max VCC current after configuration turns off AUX output: 0.165A
- Max VDD current: 0.35mA
- (near U9) 100k R_Bias wil be lower: 17mA per rail was measured on the EVM
- 80uA @ V+ and 80uA @ V-
- (near C30) Test values from 10pf to 100pf

### Library data of the parts
C20 C22 = CAP 2pF 250V C0G 0603: Manufacturer: KEMET; Manufacturer Part Number: CBR06C309BAGAC; Value: 2pF; Supplier 1: Mouser; Supplier Part Number 1: 80-CBR06C209BAG; Package: 0603
C21 = CAP 5.1pF 250V C0G 0603: Manufacturer: KEMET; Manufacturer Part Number: CBR06C519BAGAC; Supplier 1: Mouser; Supplier Part Number 1: 80-CBR06C519BAGAC; Value: 5.1pF
C23 = CAP 240pF 250V C0G 0805: Manufacturer: Kyocera AVX; Manufacturer Part Number: 600F241FT250XT; Voltage Rating: 250V; Temperature Coefficient: C0G; Package: 0805; Supplier 1: Digi-Key; Supplier Part Number 1: 1284-1897-1-ND; Value: 240pF
C26 C27 = CAP 22nF 100V X7R 0603: Package: 0603; Value: 22nF; Supplier 1: Digi-Key; Supplier Part Number 1: 490-4782-1-ND
C28 C31 C34 C36 C39 C63 C64 C78 C101 C108-C110 C124 C127-C131 = CAP 100nF 16V X7R 0402: Voltage Rating: 16V; Package: 0402; Supplier 1: Digi-Key; Supplier Part Number 1: 490-4759-1-ND; Value: 100nF
C29 C30 = CAP 100pF 50V C0G 0402: Temperature Coefficient: C0G; Voltage Rating: 50V; Package: 0402; Value: 100pF; Supplier 1: Digi-Key; Supplier Part Number 1: 490-14349-1-ND
C32 = CAP 1nF 50V C0G 0402: Voltage Rating: 50V; Package: 0402; Supplier 1: Digi-Key; Supplier Part Number 1: 490-6189-1-ND; Value: 1nF
C33 = CAP 10nF 50V X7R 0402: Voltage Rating: 50V; Package: 0402; Supplier 1: Digi-Key; Supplier Part Number 1: 490-6351-1-ND; Value: 10nF
C35 C132 = CAP 1uF 25V X5R 0402: Voltage Rating: 25V; Package: 0402; Supplier 1: Digi-Key; Supplier Part Number 1: 490-10017-1-ND; Value: 1uF
C37 = CAP 100nF 16V X7R 0402: Manufacturer: Murata; House Part Number: C-100nF-0402-002; Manufacturer Part Number: GCM155R71C104KA55D; Voltage Rating: 16V; Package: 0402; Supplier 1: Digi-Key; Supplier Part Number 1: 490-4759-6-ND; Value: 100nF
C38 = CAP 2.2uF 10V X5R 0402: Manufacturer: Taiyo Yuden; Manufacturer Part Number: LMK105BJ225MV-F; Voltage Rating: 10V; Package: 0402; Supplier 1: Digi-Key; Supplier Part Number 1: 587-3153-1-ND; Value: 2.2uF
C102 C111 C133 = CAP 2.2uF 10V X5R 0402: Voltage Rating: 10V; Package: 0402; Supplier 1: Digi-Key; Supplier Part Number 1: 587-3153-1-ND; Value: 2.2uF
D2 D3 = DIODE 1N4148: Max Reverse Voltage: 75V; Max Current: 150mA; Supplier 1: Digi-Key; Supplier Part Number 1: 1N4148WS-FDICT-ND
FB4 FB6 R56 = RES 0 OHM 1/16W 0402: Manufacturer: Yageo; Manufacturer Part Number: RC0402JR-070RL; Supplier 1: Digi-Key; Supplier Part Number 1: 311-0.0JRCT-ND; Package: 0402; Value: 0
FB7-FB10 = FERRITE BEAD 120 OHM 0402: Supplier 1: Digi-Key; Supplier Part Number 1: 490-9656-1-ND
J2 = BNC JACK R/A: Supplier 1: Digi-Key; Supplier Part Number 1: WM5524-ND
J3 J4 = UFL Jack SMD: Supplier 1: Digi-Key; Supplier Part Number 1: A145155CT-ND
K1 K2 = RELAY DPDT-NO FTR-B3SA4.5Z: Manufacturer: Fujitsu; Supplier 1: Mouser; Supplier Part Number 1: 817-FTRB3SA4.5Z-B10; Manufacturer Part Number: FTR-B3SA4.5Z
Q3-Q5 = NMOS DMN62D0UW: Vdss: 60V; Id: 340mA; Max Power: 320mW; Supplier 1: Digi-Key; Supplier Part Number 1: DMN62D0UW-7DICT-ND
R29 = RES 30 OHM 1% 1/3W 0603: Tolerance: 1%; Value: 30; Supplier 1: Digi-Key; Supplier Part Number 1: 2019-SG73P1JTTD30R0FCT-ND
R30 R41 = RES 10 OHM 1% 1/3W 0603: Tolerance: 1%; Value: 10; Supplier 1: Digi-Key; Supplier Part Number 1: 2019-SG73P1JTTD10R0FCT-ND
R31 R43 = RES 10 OHM 1% 1/3W 0603: Manufacturer: KOA Speer; Manufacturer Part Number: SG73P1JTTD10R0F; Tolerance: 1%; Value: 10; Supplier 1: Digi-Key; Supplier Part Number 1: 2019-SG73P1JTTD10R0FCT-ND
R32 = RES 300K OHM 1% 1/10W 0402: as R11 on sheet FE; Package: 0402; Supplier 1: Digi-Key; Supplier Part Number 1: P300KLCT-ND; Value: 300K
R33 = RES 680K OHM 1% 1/16W 0402: Manufacturer: Yageo; Manufacturer Part Number: RC0402FR-07681KL; Tolerance: 1%; Package: 0402; Supplier 1: Digi-Key; Supplier Part Number 1: YAG3211CT-ND; Value: 680K
R35 = RES 20K OHM 1% 1/16W 0402: Manufacturer: Yageo; Manufacturer Part Number: RC0402FR-0720KL; Tolerance: 1%; Package: 0402; Supplier 1: Digi-Key; Supplier Part Number 1: 311-20.0KLRCT-ND; Value: 20k
R47-R51 R121 R126 = RES 10K OHM 1% 1/10W 0402: Tolerance: 1%; Power Rating: 0.1W; Package: 0402; Supplier 1: Digi-Key; Supplier Part Number 1: P10.0KLCT-ND; Value: 10K
R52 R97 R120 = RES 0 OHM 1/16W 0402: Power Rating: 0.0625W; Package: 0402; Supplier 1: Digi-Key; Supplier Part Number 1: 311-0.0JRCT-ND; Value: 0
R53 R54 = RES 30 OHM 1% 1/3W 0603: Manufacturer: KOA Speer; Manufacturer Part Number: SG73P1JTTD30R0F; Tolerance: 1%; Package: 0603; Value: 30; Supplier 1: Digi-Key; Supplier Part Number 1: 2019-SG73P1JTTD30R0FCT-ND
R55 = RES 100K OHM 1% 1/10W 0402: Tolerance: 1%; Power Rating: 0.1W; Package: 0402; Value: 100k; Supplier 1: Digi-Key; Supplier Part Number 1: 311-100KLRCT-ND
R65 R96 = RES 909K OHM 1% 1/16W 0402: Tolerance: 1%; Power Rating: 0.0625W; Package: 0402; Supplier 1: Digi-Key; Supplier Part Number 1: YAG2377CT-ND; Value: 909k
R98 R99 R122 = RES 90.9K OHM 1% 1/16W 0402: Tolerance: 1%; Power Rating: 0.0625W; Package: 0402; Supplier 1: Digi-Key; Supplier Part Number 1: 311-90.9KLRCT-ND; Value: 90.9k
R100 = RES 2K OHM 1% 1/16W 0402: Tolerance: 1%; Power Rating: 0.0625W; Package: 0402; Supplier 1: Digi-Key; Supplier Part Number 1: 311-2KLRCT-ND; Value: 2K
R118 R119 = RES 1K OHM 1% 1/10W 0402: Tolerance: 1%; Power Rating: 0.1W; Package: 0402; Supplier 1: Digi-Key; Supplier Part Number 1: 311-1.00KLRCT-ND; Value: 1K
R123 = RES DNP 0402: Tolerance: 1%; Power Rating: 0.0625W; Package: 0402; Value: DNP
R124 = TRIMMER 5K OHM 0.1W J LEAD TOP: Tolerance: 1%; Power Rating: 0.1W; Supplier 1: Digi-Key; Supplier Part Number 1: TC33X-502ECT-ND; Value: 5K
R125 R127 = RES 10K OHM 1% 1/10W 0402: Manufacturer: Panasonic; Manufacturer Part Number: ERJ-2RKF1002X; Tolerance: 1%; Package: 0402; Supplier 1: Digi-Key; Supplier Part Number 1: P10.0KLCT-ND; Value: 10K
SHLD2 = SHIELD 2118727-2: Supplier 1: Digi-Key; Supplier Part Number 1: A126132-ND
SHLD3 = SHIELD 2118728-2: Supplier 1: Digi-Key; Supplier Part Number 1: A126158CT-ND
TP22-TP26 = TP PCB 1mm
U7 = IC PGA LMH6518: Supplier 1: Digi-Key; Supplier Part Number 1: LMH6518SQE/NOPBCT-ND
U9 = IC BUFFER AMP BUF802: Supplier 1: Mouser; Supplier Part Number 1: 595-BUF802IRGTR
U10 = IC SWITCH SPST TS12A4516DBVR: Manufacturer: Texas Instruments; Supplier 1: Digi-Key; Supplier Part Number 1: 296-24269-1-ND; Manufacturer Part Number: TS12A4516DBVR
U18 = IC OPAMP OP07CDR: Supplier 1: Digi-Key; Supplier Part Number 1: 296-14626-1-ND

## Sheet ADC.SchDoc: ThunderScope 1000E
size A4; DrawnBy: Aleksa Bjelogrlic; Revision: 1
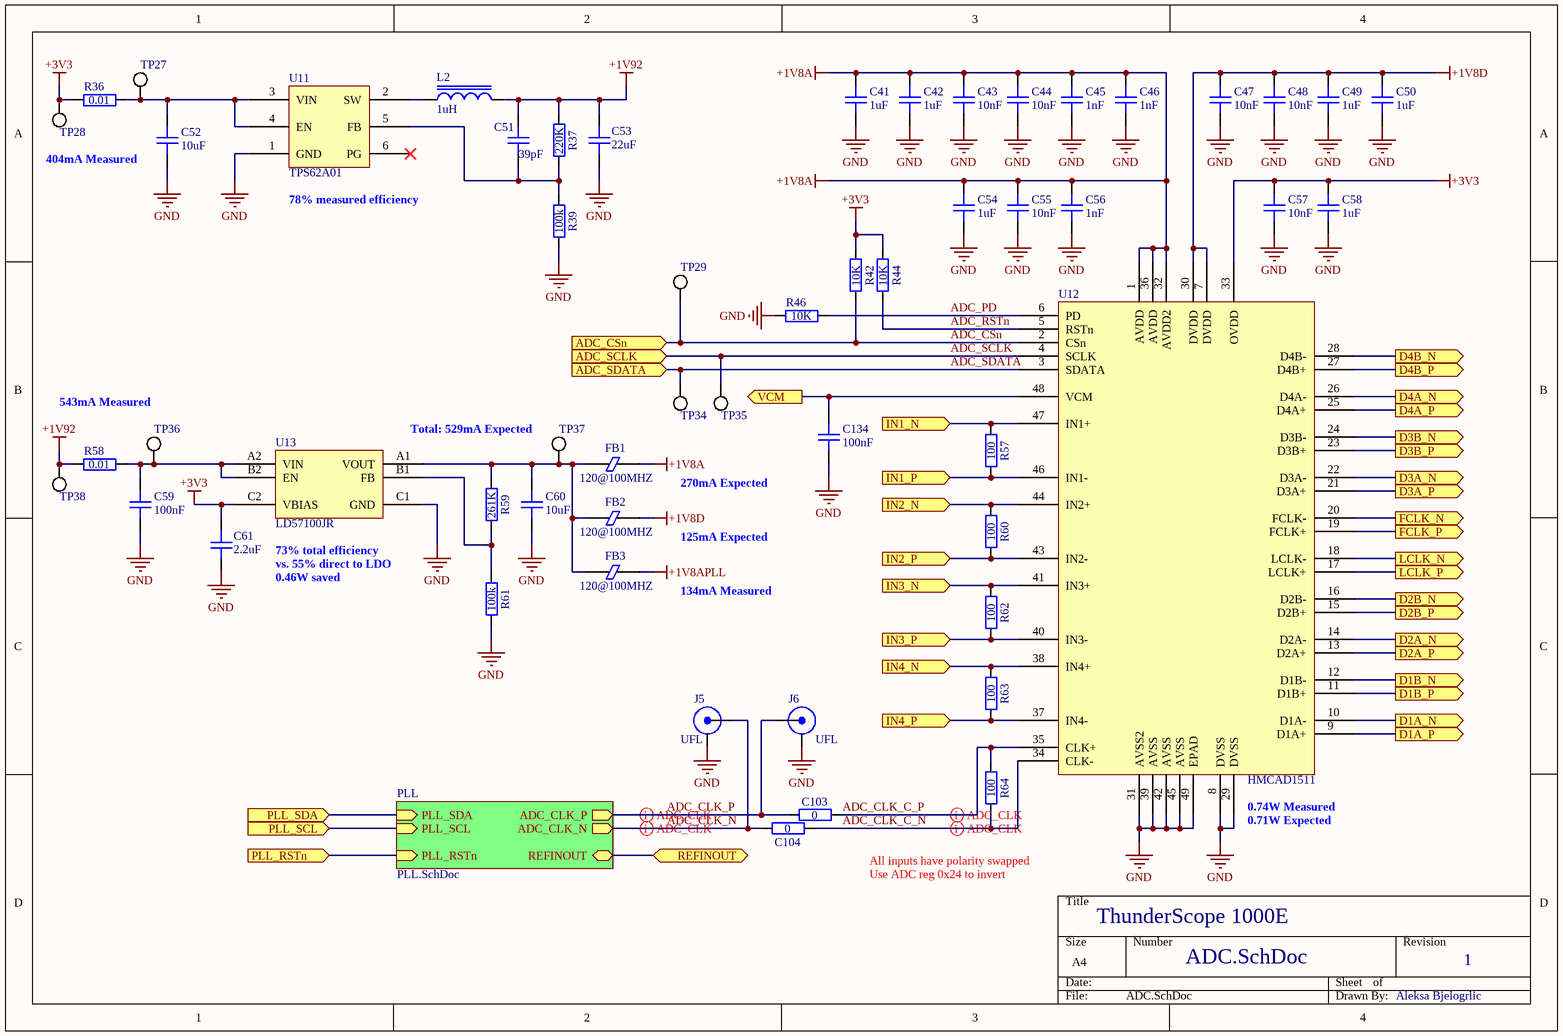
[diagram p3: ADC.SchDoc]

### Parts
C41  1uF  [GEN_C_0402]
C42  1uF  [GEN_C_0402]
C43  10nF  [GEN_C_0402]
C44  10nF  [GEN_C_0402]
C45  1nF  [GEN_C_0402]
C46  1nF  [GEN_C_0402]
C47  10nF  [GEN_C_0402]
C48  10nF  [GEN_C_0402]
C49  1uF  [GEN_C_0402]
C50  1uF  [GEN_C_0402]
C51  39pF  [GEN_C_0402]
C52  10uF  [GEN_C_0603]
C53  22uF  [GEN_C_0805]
C54  1uF  [GEN_C_0402]
C55  10nF  [GEN_C_0402]
C56  1nF  [GEN_C_0402]
C57  10nF  [GEN_C_0402]
C58  1uF  [GEN_C_0402]
C59  100nF  [GEN_C_0402]
C60  10uF  [GEN_C_0603]
C61  2.2uF  [GEN_C_0402]
C103  0  [GEN_R_0402]
C104  0  [GEN_R_0402]
C134  100nF  [GEN_C_0402]
FB1  120@100MHZ  [GEN_R_0402]
FB2  120@100MHZ  [GEN_R_0402]
FB3  120@100MHZ  [GEN_R_0402]
J5  UFL  [TE_2334884-1]
J6  UFL  [TE_2334884-1]
L2  1uH  [GEN_L_1210]
R36  0.01  [GEN_R_0603]
R37  220K  [GEN_R_0402]
R39  100k  [GEN_R_0402]
R42  10K  [GEN_R_0402]
R44  10K  [GEN_R_0402]
R46  10K  [GEN_R_0402]
R57  100  [GEN_R_0402]
R58  0.01  [GEN_R_0603]
R59  261K  [GEN_R_0402]
R60  100  [GEN_R_0402]
R61  100k  [GEN_R_0402]
R62  100  [GEN_R_0402]
R63  100  [GEN_R_0402]
R64  100  [GEN_R_0402]
TP27  PCB  [GEN_TP_PCB]  (value not drawn)  (no BOM)
TP28  PCB  [GEN_TP_PCB]  (value not drawn)  (no BOM)
TP29  PCB  [GEN_TP_PCB]  (value not drawn)  (no BOM)
TP34  PCB  [GEN_TP_PCB]  (value not drawn)  (no BOM)
TP35  PCB  [GEN_TP_PCB]  (value not drawn)  (no BOM)
TP36  PCB  [GEN_TP_PCB]  (value not drawn)  (no BOM)
TP37  PCB  [GEN_TP_PCB]  (value not drawn)  (no BOM)
TP38  PCB  [GEN_TP_PCB]  (value not drawn)  (no BOM)
U11  TPS62A01  [TI_SOT563_DRL0006A]
U12  HMCAD1511  [AD_QFN48_LP7]
U13  LD57100JR  [ST_FlipChip6]

### Sub-sheets
PLL = PLL.SchDoc: ADC_CLK_P (out), ADC_CLK_N (out), PLL_RSTn (in), PLL_SDA (in), PLL_SCL (in), REFINOUT (bidir)

### Ports
ADC_CSn (in), ADC_SCLK (in), ADC_SDATA (in), D1A_N (out), D1A_P (out), D1B_N (out), D1B_P (out), D2A_N (out), D2A_P (out), D2B_N (out), D2B_P (out), D3A_N (out), D3A_P (out), D3B_N (out), D3B_P (out), D4A_N (out), D4A_P (out), D4B_N (out), D4B_P (out), FCLK_N (out), FCLK_P (out), IN1_N (in), IN1_P (in), IN2_N (in), IN2_P (in), IN3_N (in), IN3_P (in), IN4_N (in), IN4_P (in), LCLK_N (out), LCLK_P (out), PLL_RSTn (in), PLL_SCL (in), PLL_SDA (in), REFINOUT (bidir), VCM (out)

### Nets
+1V8A: C41.2 C42.2 C43.2 C44.2 C45.2 C46.2 C54.2 C55.2 C56.2 FB1.2 U12.1(AVDD) U12.32(AVDD2) U12.36(AVDD)
+1V8APLL: FB3.2
+1V8D: C47.2 C48.2 C49.2 C50.2 FB2.2 U12.7(DVDD) U12.30(DVDD)
+1V92: C51.2 C53.2 L2.2 R37.2 R58.1 TP38.1
+3V3: C57.2 C58.2 C61.2 R36.1 R42.2 R44.2 TP28.1 U12.33(OVDD) U13.C2(VBIAS)
GND: C41.1 C42.1 C43.1 C44.1 C45.1 C46.1 C47.1 C48.1 C49.1 C50.1 C52.1 C53.1 C54.1 C55.1 C56.1 C57.1 C58.1 C59.1 C60.1 C61.1 C134.1 J5.2(SHIELD) J6.2(SHIELD) R39.1 R46.2 R61.1 U11.1(GND) U12.8(DVSS) U12.29(DVSS) U12.31(AVSS2) U12.39(AVSS) U12.42(AVSS) U12.45(AVSS) U12.49(EPAD) U13.C1(GND)
ADC_CLK_C_N: C104.1 R64.1 U12.34(CLK-)
ADC_CLK_C_P: C103.1 R64.2 U12.35(CLK+)
ADC_CLK_N: C104.2 J5.1(Signal) ; sheet PLL/ADC_CLK_N
ADC_CLK_P: C103.2 J6.1(Signal) ; sheet PLL/ADC_CLK_P
ADC_CSn: R42.1 TP29.1 U12.2(CSn) ; port ADC_CSn
ADC_PD: R46.1 U12.6(PD)
ADC_RSTn: R44.1 U12.5(RSTn)
ADC_SCLK: TP35.1 U12.4(SCLK) ; port ADC_SCLK
ADC_SDATA: TP34.1 U12.3(SDATA) ; port ADC_SDATA
CH1_N: R57.2 U12.47(IN1+) ; port IN1_N
CH1_P: R57.1 U12.46(IN1-) ; port IN1_P
CH2_N: R60.2 U12.44(IN2+) ; port IN2_N
CH2_P: R60.1 U12.43(IN2-) ; port IN2_P
CH3_N: R62.2 U12.41(IN3+) ; port IN3_N
CH3_P: R62.1 U12.40(IN3-) ; port IN3_P
CH4_N: R63.2 U12.38(IN4+) ; port IN4_N
CH4_P: R63.1 U12.37(IN4-) ; port IN4_P
D1A_N: U12.10(D1A-) ; port D1A_N
D1A_P: U12.9(D1A+) ; port D1A_P
D1B_N: U12.12(D1B-) ; port D1B_N
D1B_P: U12.11(D1B+) ; port D1B_P
D2A_N: U12.14(D2A-) ; port D2A_N
D2A_P: U12.13(D2A+) ; port D2A_P
D2B_N: U12.16(D2B-) ; port D2B_N
D2B_P: U12.15(D2B+) ; port D2B_P
D3A_N: U12.22(D3A-) ; port D3A_N
D3A_P: U12.21(D3A+) ; port D3A_P
D3B_N: U12.24(D3B-) ; port D3B_N
D3B_P: U12.23(D3B+) ; port D3B_P
D4A_N: U12.26(D4A-) ; port D4A_N
D4A_P: U12.25(D4A+) ; port D4A_P
D4B_N: U12.28(D4B-) ; port D4B_N
D4B_P: U12.27(D4B+) ; port D4B_P
FCLK_N: U12.20(FCLK-) ; port FCLK_N
FCLK_P: U12.19(FCLK+) ; port FCLK_P
LCLK_N: U12.18(LCLK-) ; port LCLK_N
LCLK_P: U12.17(LCLK+) ; port LCLK_P
PLL_RSTn: port PLL_RSTn, sheet PLL/PLL_RSTn
REFINOUT: port REFINOUT, sheet PLL/REFINOUT
SCL: port PLL_SCL, sheet PLL/PLL_SCL
SDA: port PLL_SDA, sheet PLL/PLL_SDA
VCM: C134.2 U12.48(VCM) ; port VCM
NetC51_1: C51.1 R37.1 R39.2 U11.5(FB)
NetC52_2: C52.2 R36.2 TP27.1 U11.3(VIN) U11.4(EN)
NetC59_2: C59.2 R58.2 TP36.1 U13.A2(VIN) U13.B2(EN)
NetC60_2: C60.2 FB1.1 FB2.1 FB3.1 R59.2 TP37.1 U13.A1(VOUT)
NetL2_1: L2.1 U11.2(SW)
NetR59_1: R59.1 R61.2 U13.B1(FB)

Not connected (* = marked no-connect by the designer): U11 6(PG)*

### Layout directives
differential pair: ADC_CLK_C_N, ADC_CLK_C_P, ADC_CLK_N, ADC_CLK_P

### Notes on the sheet
- 404mA Measured
- (near U11) 78% measured efficiency
- 543mA Measured
- Total: 529mA Expected
- 270mA Expected
- 73% total efficiency
- vs. 55% direct to LDO
- 0.46W saved
- 125mA Expected
- 134mA Measured
- (near U12) 0.74W Measured
- (near U12) 0.71W Expected
- All inputs have polarity swapped
- Use ADC reg 0x24 to invert
- Aleksa Bjelogrlic

### Library data of the parts
C41 C42 C49 C50 C54 C58 = CAP 1uF 25V X5R 0402: Voltage Rating: 25V; Package: 0402; Supplier 1: Digi-Key; Supplier Part Number 1: 490-10017-1-ND; Value: 1uF
C43 C44 C47 C48 C55 C57 = CAP 10nF 50V X7R 0402: Voltage Rating: 50V; Package: 0402; Supplier 1: Digi-Key; Supplier Part Number 1: 490-6351-1-ND; Value: 10nF
C45 C46 C56 = CAP 1nF 50V C0G 0402: Voltage Rating: 50V; Package: 0402; Supplier 1: Digi-Key; Supplier Part Number 1: 490-6189-1-ND; Value: 1nF
C51 = CAP 39pF 50V C0G 0402: Temperature Coefficient: C0G; Voltage Rating: 50V; Package: 0402; Value: 39pF; Supplier 1: Digi-Key; Supplier Part Number 1: 399-C0402C390J5GAC7867CT-ND
C52 C60 = CAP 10uF 10V X5R 0603: Voltage Rating: 10V; Package: 0402; Supplier 1: Digi-Key; Supplier Part Number 1: 490-10474-1-ND; Value: 10uF
C53 = CAP 22uF 25V X5R 0805: Voltage Rating: 25V; Package: 0805; Value: 22uF; Supplier 1: Digi-Key; Supplier Part Number 1: 490-10749-1-ND
C59 C134 = CAP 100nF 16V X7R 0402: Voltage Rating: 16V; Package: 0402; Supplier 1: Digi-Key; Supplier Part Number 1: 490-4759-1-ND; Value: 100nF
C61 = CAP 2.2uF 10V X5R 0402: Voltage Rating: 10V; Package: 0402; Value: 2.2uF; Supplier 1: Digi-Key; Supplier Part Number 1: 587-3153-1-ND
C103 C104 = RES 0 OHM 1/16W 0402: as FB4 on sheet FE_Channel; Package: 0402; Supplier 1: Digi-Key; Supplier Part Number 1: 311-0.0JRCT-ND; Value: 0
FB1-FB3 = FERRITE BEAD 120 OHM 0402: Supplier 1: Digi-Key; Supplier Part Number 1: 490-9656-1-ND
J5 J6 = UFL Jack SMD: Supplier 1: Digi-Key; Supplier Part Number 1: A145155CT-ND
L2 = IND 1uH 3.1A 45 MOHM 1210: Value: 1uH; Supplier 1: Digi-Key; Supplier Part Number 1: 490-10590-1-ND
R36 R58 = RES 0.01 OHM 1% 1/4W 0603: Tolerance: 1%; Power Rating: 0.25W; Supplier 1: Digi-Key; Supplier Part Number 1: 408-1404-1-ND; Value: 0.01; Package: 0603
R37 = RES 220K OHM 1% 1/16W 0402: Tolerance: 1%; Power Rating: 0.0625W; Package: 0402; Value: 220K; Supplier 1: Digi-Key; Supplier Part Number 1: 311-220KLRCT-ND
R39 R61 = RES 100K OHM 1% 1/10W 0402: Tolerance: 1%; Power Rating: 0.1W; Package: 0402; Value: 100k; Supplier 1: Digi-Key; Supplier Part Number 1: 311-100KLRCT-ND
R42 R44 R46 = RES 10K OHM 1% 1/10W 0402: Tolerance: 1%; Power Rating: 0.1W; Package: 0402; Supplier 1: Digi-Key; Supplier Part Number 1: P10.0KLCT-ND; Value: 10K
R57 R60 R62-R64 = RES 100 OHM 1% 1/10W 0402: Tolerance: 1%; Power Rating: 0.1W; Package: 0402; Value: 100; Supplier 1: Digi-Key; Supplier Part Number 1: 2019-RK73H1ETTP1000FCT-ND
R59 = RES 261K OHM 1% 1/16W 0402: Tolerance: 1%; Power Rating: 0.0625W; Package: 0402; Value: 261K; Supplier 1: Digi-Key; Supplier Part Number 1: 311-261KLRCT-ND
TP27-TP29 TP34-TP38 = TP PCB 1mm
U11 = IC BUCK TPS62A01: Supplier 1: Mouser; Supplier Part Number 1: 595-TPS62A01DRLR
U12 = IC ADC HMCAD1511: Supplier 1: Digi-Key; Supplier Part Number 1: 1127-1648-ND
U13 = IC LDO LD57100JR: Supplier 1: Digi-Key; Supplier Part Number 1: 497-LD57100JRCT-ND

## Sheet PLL.SchDoc: ThunderScope 1000E
size A4
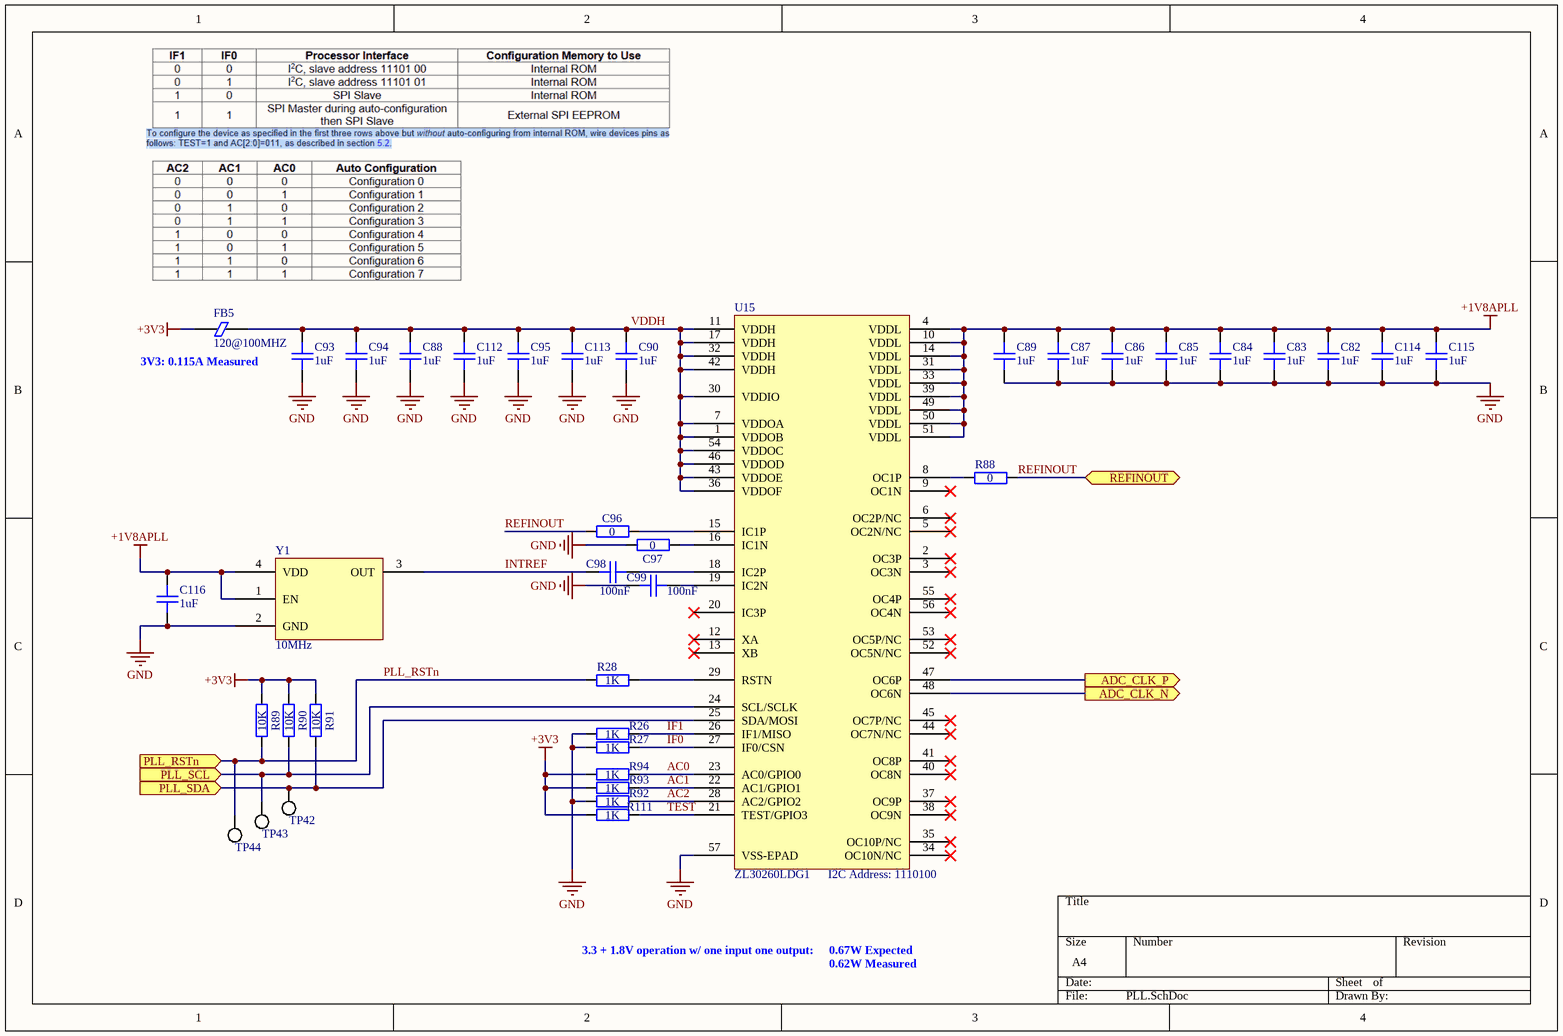
[diagram p4: PLL.SchDoc]

### Parts
C82  1uF  [GEN_C_0402]
C83  1uF  [GEN_C_0402]
C84  1uF  [GEN_C_0402]
C85  1uF  [GEN_C_0402]
C86  1uF  [GEN_C_0402]
C87  1uF  [GEN_C_0402]
C88  1uF  [GEN_C_0402]
C89  1uF  [GEN_C_0402]
C90  1uF  [GEN_C_0402]
C93  1uF  [GEN_C_0402]
C94  1uF  [GEN_C_0402]
C95  1uF  [GEN_C_0402]
C96  0  [GEN_R_0402]
C97  0  [GEN_R_0402]
C98  100nF  [GEN_C_0402]
C99  100nF  [GEN_C_0402]
C112  1uF  [GEN_C_0402]
C113  1uF  [GEN_C_0402]
C114  1uF  [GEN_C_0402]
C115  1uF  [GEN_C_0402]
C116  1uF  [GEN_C_0402]
FB5  120@100MHZ  [GEN_R_0402]
R26  1K  [GEN_R_0402]
R27  1K  [GEN_R_0402]
R28  1K  [GEN_R_0402]
R88  0  [GEN_R_0402]
R89  10K  [GEN_R_0402]
R90  10K  [GEN_R_0402]
R91  10K  [GEN_R_0402]
R92  1K  [GEN_R_0402]
R93  1K  [GEN_R_0402]
R94  1K  [GEN_R_0402]
R111  1K  [GEN_R_0402]
TP42  PCB  [GEN_TP_PCB]  (value not drawn)  (no BOM)
TP43  PCB  [GEN_TP_PCB]  (value not drawn)  (no BOM)
TP44  PCB  [GEN_TP_PCB]  (value not drawn)  (no BOM)
U15  ZL30260LDG1  [MC_QFN56_ZL30260]
Y1  10MHz  [ECS_TXO-3225]

### Ports
ADC_CLK_N (out), ADC_CLK_P (out), PLL_RSTn (in), PLL_SCL (in), PLL_SDA (in), REFINOUT (bidir)

### Nets
+1V8APLL: C82.1 C83.1 C84.1 C85.1 C86.1 C87.1 C89.1 C114.1 C115.1 C116.1 U15.4(VDDL) U15.10(VDDL) U15.14(VDDL) U15.31(VDDL) U15.33(VDDL) U15.39(VDDL) U15.49(VDDL) U15.50(VDDL) U15.51(VDDL) Y1.1(EN) Y1.4(VDD)
+3V3: FB5.1 R89.2 R90.2 R91.2 R93.1 R94.1 R111.1
GND: C82.2 C83.2 C84.2 C85.2 C86.2 C87.2 C88.2 C89.2 C90.2 C93.2 C94.2 C95.2 C97.2 C99.2 C112.2 C113.2 C114.2 C115.2 C116.2 R26.1 R27.1 R92.1 U15.57(VSS-EPAD) Y1.2(GND)
AC0: R94.2 U15.23(AC0/GPIO0)
AC1: R93.2 U15.22(AC1/GPIO1)
AC2: R92.2 U15.28(AC2/GPIO2)
ADC_CLK_N: U15.48(OC6N) ; port ADC_CLK_N
ADC_CLK_P: U15.47(OC6P) ; port ADC_CLK_P
IF0: R27.2 U15.27(IF0/CSN)
IF1: R26.2 U15.26(IF1/MISO)
INTREF: C98.2 Y1.3(OUT)
PLL_RSTn: R28.2 R89.1 TP44.1 ; port PLL_RSTn
REFINOUT: C96.2 R88.2 ; port REFINOUT
SCL: R90.1 TP43.1 U15.24(SCL/SCLK) ; port PLL_SCL
SDA: R91.1 TP42.1 U15.25(SDA/MOSI) ; port PLL_SDA
TEST: R111.2 U15.21(TEST/GPIO3)
VDDH: C88.1 C90.1 C93.1 C94.1 C95.1 C112.1 C113.1 FB5.2 U15.1(VDDOB) U15.7(VDDOA) U15.11(VDDH) U15.17(VDDH) U15.30(VDDIO) U15.32(VDDH) U15.36(VDDOF) U15.42(VDDH) U15.43(VDDOE) U15.46(VDDOD) U15.54(VDDOC)
NetC96_1: C96.1 U15.15(IC1P)
NetC97_1: C97.1 U15.16(IC1N)
NetC98_1: C98.1 U15.18(IC2P)
NetC99_1: C99.1 U15.19(IC2N)
NetR28_1: R28.1 U15.29(RSTN)
NetR88_1: R88.1 U15.8(OC1P)

Not connected (* = marked no-connect by the designer): U15 2(OC3P)* 3(OC3N)* 5(OC2N/NC)* 6(OC2P/NC)* 9(OC1N)* 12(XA)* 13(XB)* 20(IC3P)* 34(OC10N/NC)* 35(OC10P/NC)* 37(OC9P)* 38(OC9N)* 40(OC8N)* 41(OC8P)* 44(OC7N/NC)* 45(OC7P/NC)* 52(OC5N/NC)* 53(OC5P/NC)* 55(OC4P)* 56(OC4N)*

### Notes on the sheet
- 3V3: 0.115A Measured
- (near U15) I2C Address: 1110100
- 3.3 + 1.8V operation w/ one input one output:
- 0.62W Measured
- 0.67W Expected

### Library data of the parts
C82-C90 C93-C95 C112-C116 = CAP 1uF 25V X5R 0402: Voltage Rating: 25V; Package: 0402; Supplier 1: Digi-Key; Supplier Part Number 1: 490-10017-1-ND; Value: 1uF
C96 C97 = RES 0 OHM 1/16W 0402: as FB4 on sheet FE_Channel; Package: 0402; Supplier 1: Digi-Key; Supplier Part Number 1: 311-0.0JRCT-ND; Value: 0
C98 C99 = CAP 100nF 16V X7R 0402: Voltage Rating: 16V; Package: 0402; Supplier 1: Digi-Key; Supplier Part Number 1: 490-4759-1-ND; Value: 100nF
FB5 = FERRITE BEAD 120 OHM 0402: Supplier 1: Digi-Key; Supplier Part Number 1: 490-9656-1-ND
R26-R28 R92-R94 R111 = RES 1K OHM 1% 1/10W 0402: Manufacturer: Yageo; House Part Number: R-1K-0402-1%-001; Manufacturer Part Number: RC0402FR-071KL; Tolerance: 1%; Package: 0402; Supplier 1: Digi-Key; Supplier Part Number 1: 311-1.00KLRCT-ND; Value: 1K
R88 = RES 0 OHM 1/16W 0402: Power Rating: 0.0625W; Package: 0402; Supplier 1: Digi-Key; Supplier Part Number 1: 311-0.0JRCT-ND; Value: 0
R89-R91 = RES 10K OHM 1% 1/10W 0402: Tolerance: 1%; Power Rating: 0.1W; Package: 0402; Supplier 1: Digi-Key; Supplier Part Number 1: P10.0KLCT-ND; Value: 10K
TP42-TP44 = TP PCB 1mm
U15 = IC CLK GEN ZL30260LDG1: Manufacturer: Microchip; Manufacturer Part Number: ZL30260LDG1; Supplier 1: Mouser; Supplier Part Number 1: 494-ZL30260LDG1
Y1 = OSC 10MHz ECS-TXO-3225MV: Supplier 1: Digi-Key; Supplier Part Number 1: 50-ECS-TXO-3225MV-100-CT-ND